# EAGLE schematic DobbelSteen_no_programing_header (EAGLE 6.5.0)
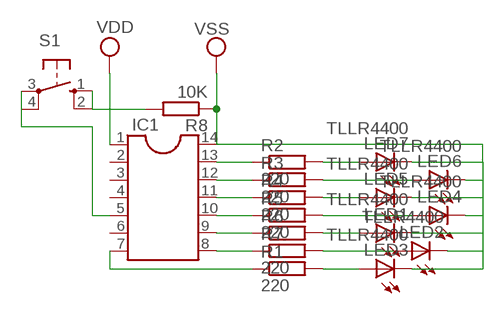
[diagram p0: schematic, sheet 1]

## Parts
IC1  DIL14S  [SOCKET-14]
LED1  TLLR4400  [LED3MM]
LED2  TLLR4400  [LED3MM]
LED3  TLLR4400  [LED3MM]
LED4  TLLR4400  [LED3MM]
LED5  TLLR4400  [LED3MM]
LED6  TLLR4400  [LED3MM]
LED7  TLLR4400  [LED3MM]
R1  220  R0204/7  [0204/7]
R2  220  R0204/7  [0204/7]
R3  220  R0204/7  [0204/7]
R4  220  R0204/7  [0204/7]
R5  220  R0204/7  [0204/7]
R6  R0204/7  [0204/7]
R7  220  R0204/7  [0204/7]
R8  10K  R0204/7  [0204/7]
S1  10-XX  [B3F-10XX]

## Nets
N$1: IC1.13 R2.1
N$2: IC1.12 R3.1
N$3: IC1.11 R4.1
N$4: IC1.10 R5.1
N$5: IC1.9 R6.1
N$6: IC1.8 R7.1
N$7: IC1.7 R1.1
N$8: LED7.A R2.2
N$9: LED6.A R3.2
N$10: LED5.A R4.2
N$11: LED4.A R5.2
N$12: LED1.A R6.2
N$13: LED2.A R7.2
N$14: LED3.A R1.2
N$16: R8.2 S1.1(S) S1.2(S1)
N$17: IC1.5 S1.3(P) S1.4(P1)
VDD: IC1.1
VSS: IC1.14 LED1.K(C) LED2.K(C) LED3.K(C) LED4.K(C) LED5.K(C) LED6.K(C) LED7.K(C) R8.1
Unconnected: IC1.2 IC1.3 IC1.4 IC1.6

## Library data of the parts
IC1 = ic-package:DIL14: Dual In Line / Socket
LED1-LED7 = led:TLLR4400: Low Current (2mA) LED 3 mm Tinted Diffused Package color RED Source: Data sheet <http://www.farnell.com/datasheets/391100.pdf>; MF: VISHAY SEMICONDUCTOR; OC_FARNELL: 1612437
R1-R8 = eagle-ltspice:R: RESISTOR, European symbol; SPICEMODEL: NONE; SPICEPREFIX: R
S1 = switch-omron:10-XX: OMRON SWITCH; MPN: B3F-1000; OC_FARNELL: 176432; OC_NEWARK: 36M3542